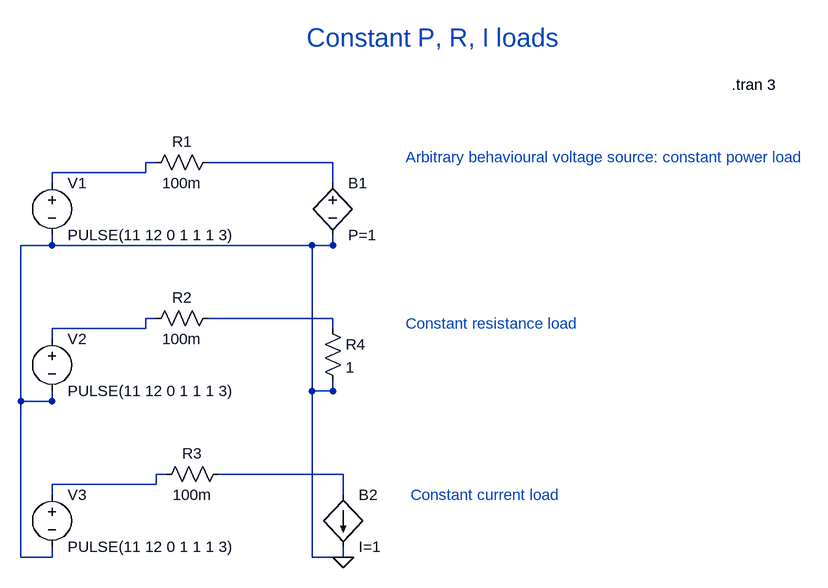
[diagram p0: schematic constant-P-R-I-loads.asc]
constant-P-R-I-loads.asc, the LTspice schematic file:
Version 4.1
SHEET 1 1128 760
WIRE 352 208 352 224
WIRE 368 688 368 704
WIRE 352 432 352 448
WIRE -80 208 -80 224
WIRE -80 448 -80 464
WIRE -80 688 -80 704
WIRE 352 224 320 224
WIRE 320 224 320 448
WIRE 320 448 352 448
WIRE 352 448 320 448
WIRE 320 448 320 704
WIRE 320 704 368 704
WIRE 352 224 -80 224
WIRE -80 224 -128 224
WIRE -128 224 -128 464
WIRE -128 464 -80 464
WIRE -80 464 -128 464
WIRE -128 464 -128 704
WIRE -128 704 -80 704
FLAG 368 704 0
WIRE 80 96 64 96
WIRE -80 128 -80 112
WIRE 64 96 64 112
WIRE 64 112 -80 112
WIRE 352 128 352 112
WIRE 160 96 176 96
WIRE 352 112 352 96
WIRE 352 96 176 96
WIRE 80 336 64 336
WIRE -80 368 -80 352
WIRE 64 336 64 352
WIRE 64 352 -80 352
WIRE 160 336 176 336
WIRE 352 352 352 336
WIRE 176 336 352 336
WIRE 96 576 80 576
WIRE -80 608 -80 592
WIRE 80 576 80 592
WIRE 80 592 -80 592
WIRE 368 608 368 592
WIRE 176 576 192 576
WIRE 368 592 368 576
WIRE 368 576 192 576
SYMBOL bv 352 112 R0
SYMATTR InstName B1
SYMATTR Value P=1
SYMBOL res 64 112 R270
WINDOW 0 32 56 VTop 2
WINDOW 3 0 56 VBottom 2
SYMATTR InstName R1
SYMATTR Value 100m
SYMBOL voltage -80 112 R0
WINDOW 123 0 0 Left 0
WINDOW 39 0 0 Left 0
SYMATTR InstName V1
SYMATTR Value PULSE(11 12 0 1 1 1 3)
SYMBOL res 64 352 R270
WINDOW 0 32 56 VTop 2
WINDOW 3 0 56 VBottom 2
SYMATTR InstName R2
SYMATTR Value 100m
SYMBOL voltage -80 352 R0
WINDOW 123 0 0 Left 0
WINDOW 39 0 0 Left 0
SYMATTR InstName V2
SYMATTR Value PULSE(11 12 0 1 1 1 3)
SYMBOL res 80 592 R270
WINDOW 0 32 56 VTop 2
WINDOW 3 0 56 VBottom 2
SYMATTR InstName R3
SYMATTR Value 100m
SYMBOL voltage -80 592 R0
WINDOW 123 0 0 Left 0
WINDOW 39 0 0 Left 0
SYMATTR InstName V3
SYMATTR Value PULSE(11 12 0 1 1 1 3)
SYMBOL res 336 336 R0
SYMATTR InstName R4
SYMATTR Value 1
SYMBOL bi 368 608 R0
SYMATTR InstName B2
SYMATTR Value I=1
TEXT 464 88 Left 2 ;Arbitrary behavioural voltage source: constant power load
TEXT 464 344 Left 2 ;Constant resistance load
TEXT 472 608 Left 2 ;Constant current load
TEXT 312 -96 Left 4 ;Constant P, R, I loads
TEXT 966 -24 Left 2 !.tran 3

The netlist it stands for:
* constant-P-R-I-loads.asc
B1 N002 0 P=1
R1 N001 N002 100m
V1 N001 0 PULSE(11 12 0 1 1 1 3)
R2 N003 N004 100m
V2 N003 0 PULSE(11 12 0 1 1 1 3)
R3 N005 N006 100m
V3 N005 0 PULSE(11 12 0 1 1 1 3)
R4 N004 0 1
B2 N006 0 I=1
* Arbitrary behavioural voltage source: constant power load
* Constant resistance load
* Constant current load
* Constant P, R, I loads
.tran 3
.backanno
.end